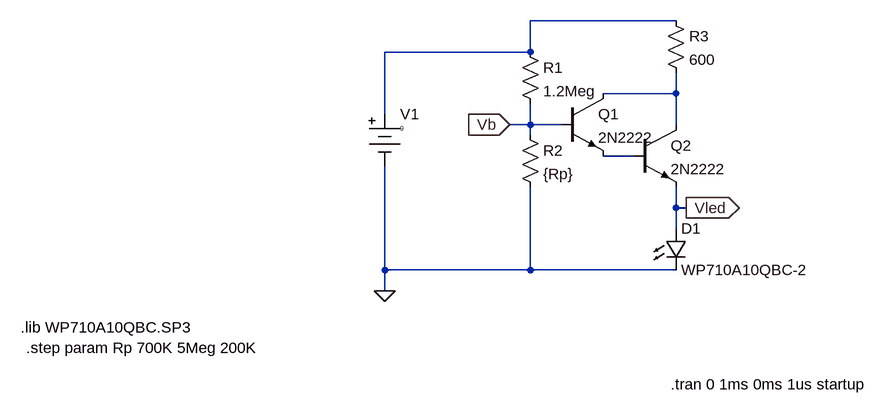
[diagram p0: schematic Photosensor.asc]
Photosensor.asc, the LTspice schematic file:
Version 4
SHEET 1 936 680
WIRE 304 -96 80 -96
WIRE 80 -48 80 -96
WIRE 80 -48 -144 -48
WIRE 304 16 304 -16
WIRE 304 16 192 16
WIRE -144 48 -144 -48
WIRE 80 64 80 32
WIRE 80 64 48 64
WIRE 128 64 80 64
WIRE 304 64 304 16
WIRE 80 80 80 64
WIRE 240 112 192 112
WIRE 304 192 304 160
WIRE 320 192 304 192
WIRE 304 224 304 192
WIRE -144 288 -144 128
WIRE 80 288 80 160
WIRE 80 288 -144 288
WIRE 304 288 80 288
WIRE -144 320 -144 288
FLAG -144 320 0
FLAG 48 64 Vb
IOPIN 48 64 In
FLAG 320 192 Vled
IOPIN 320 192 Out
SYMBOL battery -144 32 R0
WINDOW 123 0 0 Left 0
WINDOW 3 24 38 Left 0
SYMATTR InstName V1
SYMATTR Value 9
SYMATTR SpiceLine Rser=0
SYMBOL res 64 -64 R0
SYMATTR InstName R1
SYMATTR Value 1.2Meg
SYMBOL res 64 64 R0
SYMATTR InstName R2
SYMATTR Value {Rp}
SYMBOL npn 128 16 R0
SYMATTR InstName Q1
SYMATTR Value 2N2222
SYMBOL npn 240 64 R0
SYMATTR InstName Q2
SYMATTR Value 2N2222
SYMBOL res 288 -112 R0
SYMATTR InstName R3
SYMATTR Value 600
SYMBOL LED 288 224 R0
SYMATTR InstName D1
SYMATTR Value WP710A10QBC-2
TEXT -704 376 Left 2 !.lib WP710A10QBC.SP3
TEXT 296 464 Left 2 !.tran 0 1ms 0ms 1us startup
TEXT -696 408 Left 2 !.step param Rp 700K 5Meg 200K

The netlist it stands for:
* Photosensor.asc
V1 N001 0 9 Rser=0
R1 N001 Vb 1.2Meg
R2 Vb 0 {Rp}
Q1 N002 Vb N003 0 2N2222
Q2 N002 N003 Vled 0 2N2222
R3 N001 N002 600
D1 Vled 0 WP710A10QBC-2
.model D D
.lib standard.dio
.model NPN NPN
.model PNP PNP
.lib standard.bjt
.lib WP710A10QBC.SP3
.tran 0 1ms 0ms 1us startup
.step param Rp 700K 5Meg 200K
.backanno
.end